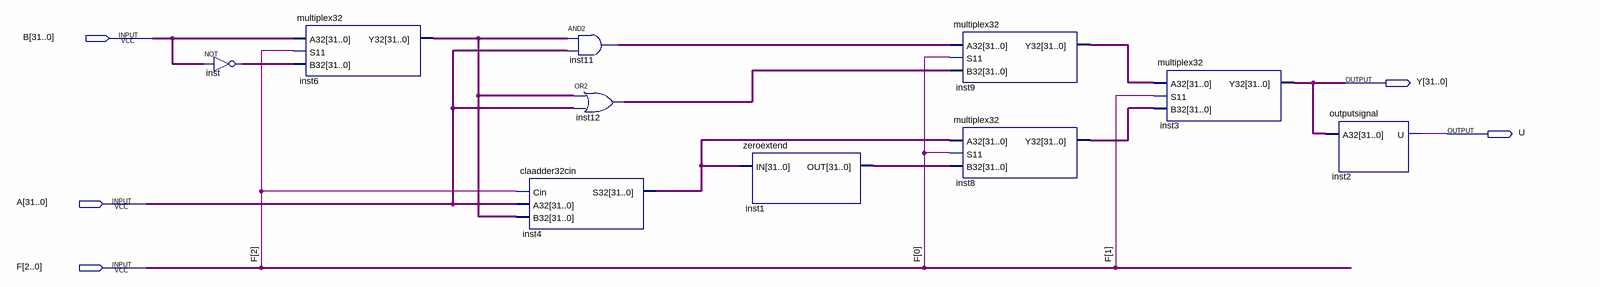
[diagram p0: schematic sheet]
// Quartus schematic aluextended.bdf as structural Verilog: 10 symbols, 5 pins
module aluextended (
  input  [31:0] B,
  input  [31:0] A,
  input  [2:0] F,
  output [31:0] Y,
  output U
);

  wire [31:0] inst1_out, inst4_s32, inst6_y32, inst8_y32, inst9_y32, inst11_out, inst12_out, inst_out;

  assign inst_out = ~B;  // NOT inst, 32 bits wide
  multiplex32 inst6 (.A32(B), .S11(F[2]), .B32(inst_out), .Y32(inst6_y32));
  claadder32cin inst4 (.Cin(F[2]), .A32(A), .B32(inst6_y32), .S32(inst4_s32));
  assign inst11_out = inst6_y32 & A;  // AND2 inst11, 32 bits wide
  assign inst12_out = inst6_y32 | A;  // OR2 inst12, 32 bits wide
  zeroextend inst1 (.IN(inst4_s32), .OUT(inst1_out));
  multiplex32 inst9 (.A32(inst11_out), .S11(F[0]), .B32(inst12_out), .Y32(inst9_y32));
  multiplex32 inst8 (.A32(inst4_s32), .S11(F[0]), .B32(inst1_out), .Y32(inst8_y32));
  multiplex32 inst3 (.A32(inst9_y32), .S11(F[1]), .B32(inst8_y32), .Y32(Y));
  outputsignal inst2 (.A32(Y), .U(U));
endmodule
